# EAGLE schematic electrical_scheme (EAGLE 9.5.1)
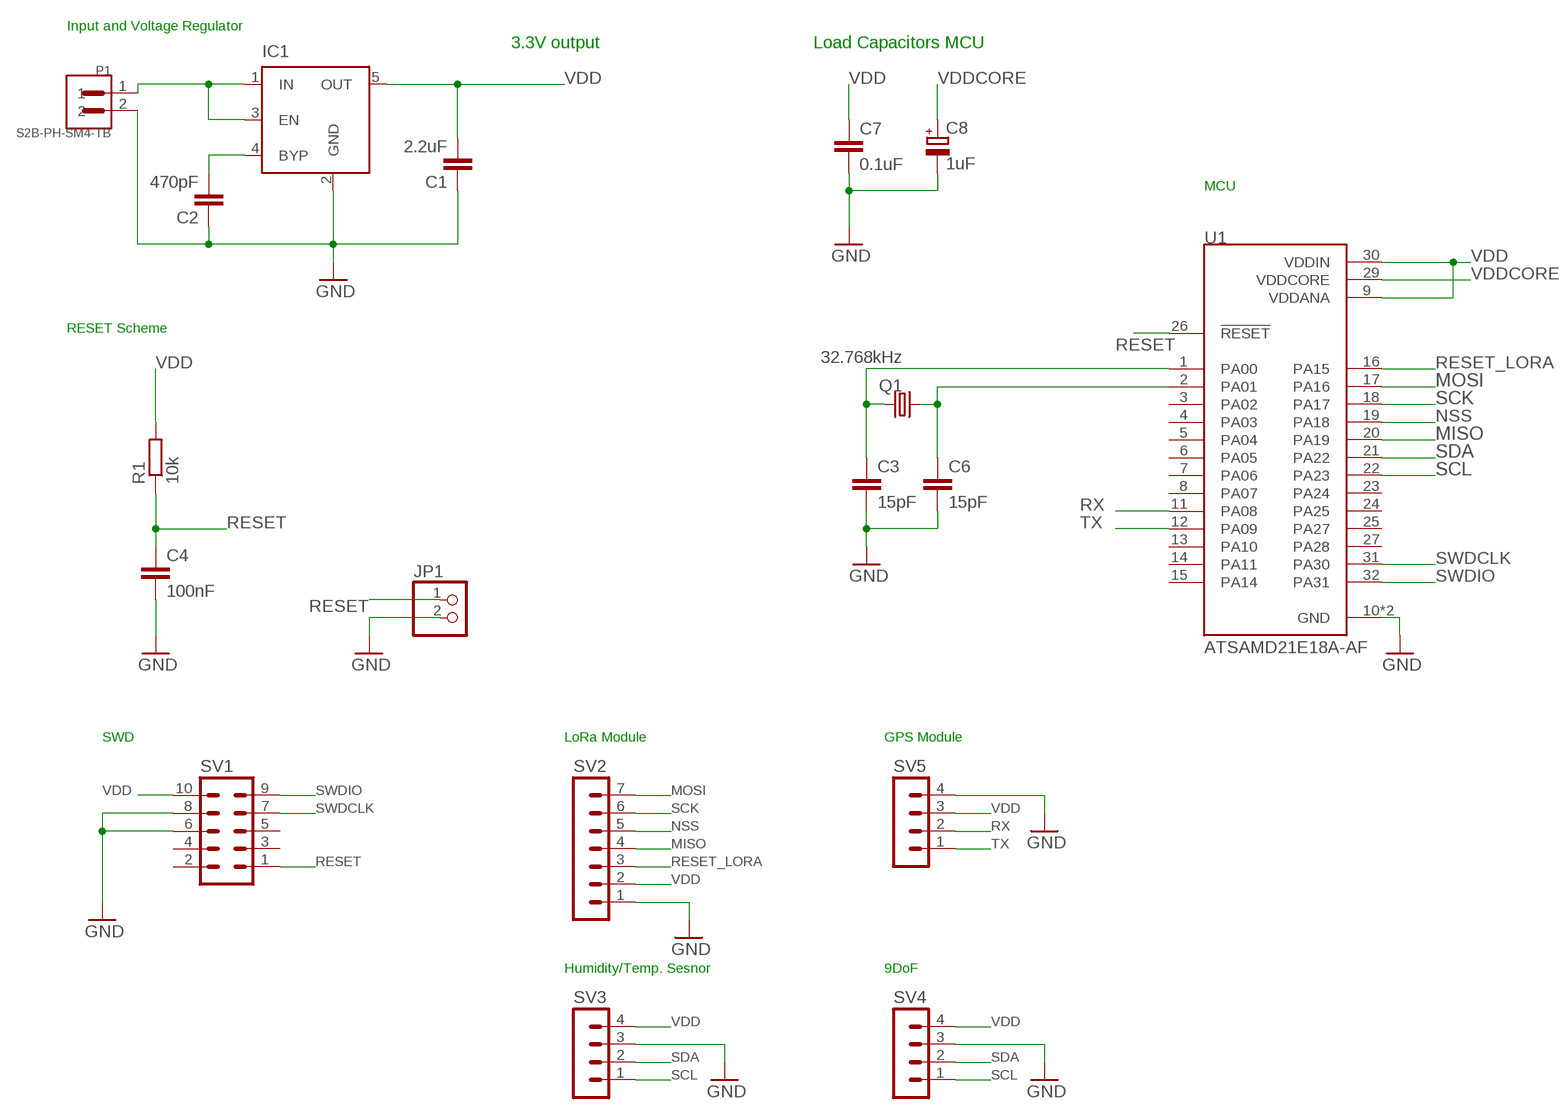
[diagram p0: schematic, sheet 1]

## Parts
C1  2.2uF  C-EUC1608  [C1608]
C2  470pF  C-EUC1608  [C1608]
C3  15pF  C-EUC1608  [C1608]
C4  100nF  C-EUC1608  [C1608]
C6  15pF  C-EUC1608  [C1608]
C7  0.1uF  C-EUC1608  [C1608]
C8  1uF  CPOL-EUC/6032-28R  [C/6032-28R]
IC1  MIC5219XX  [SOT23-5]
JP1  PINHD-1X2  [1X02]
P1  S2B-PH-SM4-TB  [JST_S2B-PH-SM4-TB]
Q1  32.768kHz  MC-306  [MC-306]
R1  10k  R-EU_R0805  [R0805]
SV1  MA05-2  [MA05-2]
SV2  MA07-1  [MA07-1]
SV3  MA04-1  [MA04-1]
SV4  MA04-1  [MA04-1]
SV5  MA04-1  [MA04-1]
U1  ATSAMD21E18A-AF  [QFP80P900X900X120-32N]

## Nets
GND: C1.1 C2.1 C3.2 C4.2 C6.2 C7.2 C8.- IC1.2(GND) JP1.2 P1.2 SV1.6 SV1.8 SV2.1 SV3.3 SV4.3 SV5.4 U1.10(GND) U1.28(GND)
MISO: SV2.4 U1.20(PA19)
MOSI: SV2.7 U1.17(PA16)
N$1: C2.2 IC1.4(BYP)
N$2: IC1.1(IN) IC1.3(EN) P1.1
N$4: C3.1 Q1.1 U1.1(PA00)
N$5: C6.1 Q1.4 U1.2(PA01)
NSS: SV2.5 U1.19(PA18)
RESET: C4.1 JP1.1 R1.1 SV1.1 U1.26(!RESET)
RESET_LORA: SV2.3 U1.16(PA15)
RX: SV5.2 U1.11(PA08)
SCK: SV2.6 U1.18(PA17)
SCL: SV3.1 SV4.1 U1.22(PA23)
SDA: SV3.2 SV4.2 U1.21(PA22)
SWDCLK: SV1.7 U1.31(PA30)
SWDIO: SV1.9 U1.32(PA31)
TX: SV5.1 U1.12(PA09)
VDD: C1.2 C7.1 IC1.5(OUT) R1.2 SV1.10 SV2.2 SV3.4 SV4.4 SV5.3 U1.9(VDDANA) U1.30(VDDIN)
VDDCORE: C8.+ U1.29(VDDCORE)
Unconnected: SV1.2 SV1.3 SV1.4 SV1.5 U1.3(PA02) U1.4(PA03) U1.5(PA04) U1.6(PA05) U1.7(PA06) U1.8(PA07) U1.13(PA10) U1.14(PA11) U1.15(PA14) U1.23(PA24) U1.24(PA25) U1.25(PA27) U1.27(PA28)

## Notes on the sheet
- Input and Voltage Regulator
- 3.3V output | Load Capacitors MCU
- MCU
- RESET Scheme
- SWD | LoRa Module | GPS Module
- Humidity/Temp. Sesnor | 9DoF

## Library data of the parts
C1-C4 C6 C7 = rcl:C-EU: CAPACITOR, European symbol; SPICEPREFIX: C
C8 = rcl:CPOL-EU: POLARIZED CAPACITOR, European symbol; SPICEPREFIX: C
IC1 = v-reg-micrel:MIC5219XX: VOLTAGE REGULATOR; OC_FARNELL: unknown; OC_NEWARK: unknown
JP1 = pinhead:PINHD-1X2: PIN HEADER
P1 = S2B-PH-SM4-TB:S2B-PH-SM4-TB: CONN HEADER PH SIDE 2POS 2MM SMD; AVAILABILITY: Unavailable; DESCRIPTION: Socket; wire-board; male; PIN: 2; 2mm; SMT; PH; 100V; 2A; -25÷85°C; MF: JST Sales; MP: S2B-PH-SM4-TB; PACKAGE: None; PRICE: None
Q1 = crystal:MC-306: kHz RANGE CRYSTAL UNIT SMD Source: MC-306_405_406_E07X.PDF Homepage <http://www.epsontoyocom.co.jp>; MPN: MC-306 60.0KHZ 100PPM ,12.5PF; OC_FARNELL: 1278040; OC_NEWARK: 31M5576
R1 = rcl:R-EU_: RESISTOR, European symbol; SPICEPREFIX: R
SV1 = con-lstb:MA05-2: PIN HEADER; OC_FARNELL: unknown; OC_NEWARK: unknown
SV2 = con-lstb:MA07-1: PIN HEADER; OC_FARNELL: unknown; OC_NEWARK: unknown
SV3-SV5 = con-lstb:MA04-1: PIN HEADER; OC_FARNELL: unknown; OC_NEWARK: unknown
U1 = ATSAMD21E18A-AF:ATSAMD21E18A-AF: The SAM D21 is a series of low-power microcontrollers using the 32-bit ARM® Cortex® -M0+ processor, and ranging from 32- to 64-pins with up to 256KB Flash and 32KB of SRAM. The SAM D21 operate at a maximum frequency of 48MHz and reach 2.46 CoreMark® /MHz.; AVAILABILITY: Unavailable; DESCRIPTION: MCU 32-Bit SAM D21E ARM Cortex M0+ RISC 256KB Flash 3.3V 32-Pin TQFP Tray; MF: Microchip; MP: ATSAMD21E18A-AF; PACKAGE: TQFP-32 Microchip; PRICE: None